# EAGLE design Fuente (EAGLE 6.3)
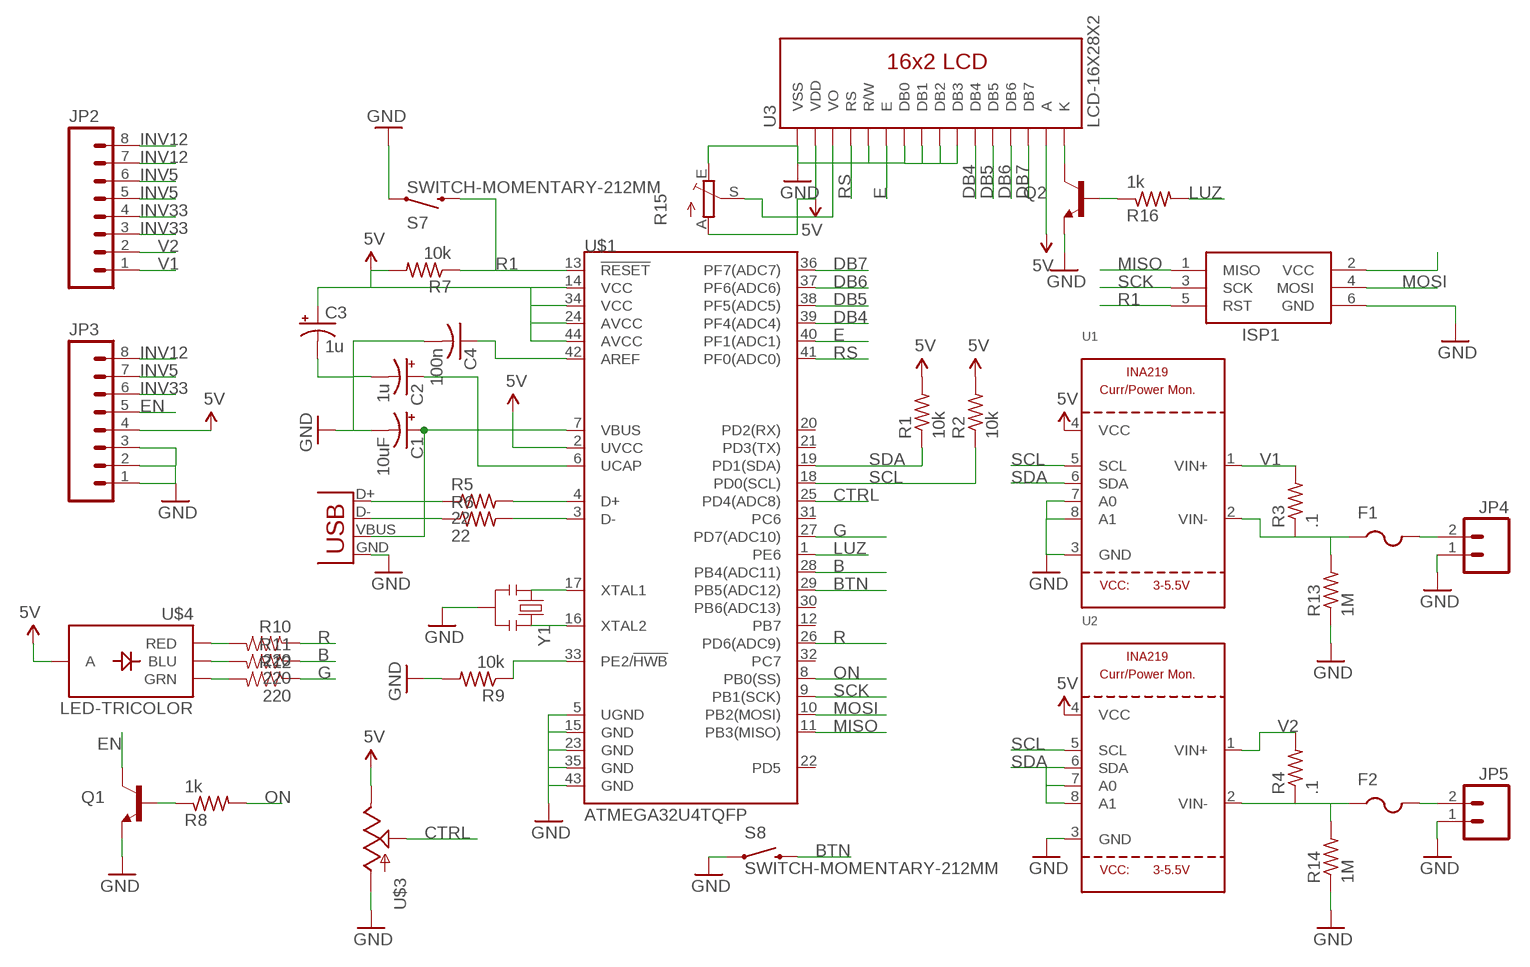
[diagram p0: schematic, sheet 1]

## Parts
C1  10uF  CAP_POLPTH2  [CPOL-RADIAL-10UF-25V]
C2  1u  CPOL-USE2.5-6  [E2,5-6]
C3  1u  CPOL-USE2.5-6  [E2,5-6]
C4  100n  C-USC0805K  [C0805K]
F1  PTCFUSE-1812  [1812]
F2  PTCFUSE-1812  [1812]
ISP1  AVRISP-6  [AVRISP]
JP1  USBSMD  [USB-MINIB]
JP2  M08LONGPADS  [1X08_LONGPADS]
JP3  M08LONGPADS  [1X08_LONGPADS]
JP4  M02LOCK_LONGPADS  [1X02_LOCK_LONGPADS]
JP5  M02LOCK_LONGPADS  [1X02_LOCK_LONGPADS]
Q1  TRANSISTOR_NPNSOT23  [SOT23]
Q2  TRANSISTOR_NPNSOT23  [SOT23]
R1  10k  R-US_M0805  [M0805]
R2  10k  R-US_M0805  [M0805]
R3  .1  R-US_R2512  [R2512]
R4  .1  R-US_R2512  [R2512]
R5  22  R-US_0309/12  [0309/12]
R6  22  R-US_0309/12  [0309/12]
R7  10k  R-US_M0805  [M0805]
R8  1k  R-US_M0805  [M0805]
R9  10k  R-US_M0805  [M0805]
R10  220  RESISTOR0805-RES  [0805]
R11  220  RESISTOR0805-RES  [0805]
R12  220  RESISTOR0805-RES  [0805]
R13  1M  R-US_M0805  [M0805]
R14  1M  R-US_M0805  [M0805]
R15  TRIM_EU-CT6  [CT6]
R16  1k  R-US_M0805  [M0805]
S7  SWITCH-MOMENTARY-212MM  [TACTILE-PTH-12MM]
S8  SWITCH-MOMENTARY-212MM  [TACTILE-PTH-12MM]
U1  INA219  [SOT23-8]
U2  INA219  [SOT23-8]
U3  LCD-16X28X2  [LCD-8X2]
U$1  ATMEGA32U4TQFP  [SPARKFUN-DIGITALIC_TQFP44]
U$3  POT-RV16AF-20  [POT_ALPHA_RV16AF-20]
U$4  LED-TRICOLOR  [LED-TRICOLOR-SMD]
Y1  RESONATORPTH  [RESONATOR-PTH]

## Nets
5V: C3.+ JP3.4 R1.2 R2.2 R7.2 R15.A U1.4(VCC) U2.4(VCC) U3.2(VDD) U3.15(A) U$1.2(UVCC) U$1.14(VCC) U$1.24(AVCC) U$1.34(VCC) U$1.44(AVCC) U$3.3(E) U$4.A
B: R11.1 U$1.28(PB4(ADC11))
BTN: S8.3 U$1.29(PB5(ADC12))
CTRL: U$1.25(PD4(ADC8)) U$3.2(S)
DB4: U3.11(DB4) U$1.39(PF4(ADC4))
DB5: U3.12(DB5) U$1.38(PF5(ADC5))
DB6: U3.13(DB6) U$1.37(PF6(ADC6))
DB7: U3.14(DB7) U$1.36(PF7(ADC7))
E: U3.6(E) U$1.40(PF1(ADC1))
EN: JP3.5 Q1.3(C)
G: R12.1 U$1.27(PD7(ADC10))
GND: C1.2(-) C2.- C3.- C4.2 ISP1.6(GND) JP1.GND JP3.1 JP3.2 JP3.3 JP4.1 JP5.1 Q1.2(E) Q2.2(E) R9.2 R13.1 R14.1 R15.E S7.1 S8.1 U1.3(GND) U1.7(A0) U1.8(A1) U2.3(GND) U3.1(VSS) U3.5(R/W) U3.7(DB0) U3.8(DB1) U3.9(DB2) U3.10(DB3) U$1.5(UGND) U$1.15(GND) U$1.23(GND) U$1.35(GND) U$1.43(GND) U$3.1(A) Y1.2
INV5: JP2.5 JP2.6 JP3.7
INV12: JP2.7 JP2.8 JP3.8
INV33: JP2.3 JP2.4 JP3.6
LUZ: R16.2 U$1.1(PE6)
MISO: ISP1.1(MISO) U$1.11(PB3(MISO))
MOSI: ISP1.4(MOSI) U$1.10(PB2(MOSI))
N$1: Q1.1(B) R8.1
N$2: F2.1 R4.1 R14.2 U2.2(VIN-)
N$3: C1.1(+) JP1.VBUS U$1.7(VBUS)
N$4: R9.1 U$1.33(PE2/!HWB)
N$5: ISP1.2(VCC)
N$6: R10.2 U$4.R(RED)
N$7: F1.1 R3.1 R13.2 U1.2(VIN-)
N$8: JP1.D+ R5.1
N$9: R5.2 U$1.4(D+)
N$10: R6.2 U$1.3(D-)
N$11: JP1.D- R6.1
N$12: U$1.17(XTAL1) Y1.1
N$13: U$1.16(XTAL2) Y1.3
N$14: R11.2 U$4.B(BLU)
N$15: R12.2 U$4.G(GRN)
N$16: F1.2 JP4.2
N$17: F2.2 JP5.2
N$18: C4.1 U$1.42(AREF)
N$19: Q2.1(B) R16.1
N$21: R15.S U3.3(VO)
N$22: C2.+ U$1.6(UCAP)
N$29: Q2.3(C) U3.16(K)
ON: R8.2 U$1.8(PB0(SS))
R: R10.1 U$1.26(PD6(ADC9))
R1: ISP1.5(RST) R7.1 S7.3 U$1.13(!RESET)
RS: U3.4(RS) U$1.41(PF0(ADC0))
SCK: ISP1.3(SCK) U$1.9(PB1(SCK))
SCL: R2.1 U1.5(SCL) U2.5(SCL) U$1.18(PD0(SCL))
SDA: R1.1 U1.6(SDA) U2.6(SDA) U2.7(A0) U2.8(A1) U$1.19(PD1(SDA))
V1: JP2.1 R3.2 U1.1(VIN+)
V2: JP2.2 R4.2 U2.1(VIN+)
Unconnected: U$1.12(PB7) U$1.20(PD2(RX)) U$1.21(PD3(TX)) U$1.22(PD5) U$1.30(PB6(ADC13)) U$1.31(PC6) U$1.32(PC7)

## Library data of the parts
C1 = SparkFun-Capacitors:CAP_POL: Capacitor Polarized These are standard SMD and PTH capacitors. Normally 10uF, 47uF, and 100uF in electrolytic and tantalum varieties. Always verify the external diameter of the through hole cap, it varies with capacity, voltage, and manufacturer. The EIA devices should be standard.
C2 C3 = adafruit:CPOL-US: POLARIZED CAPACITOR, American symbol
C4 = adafruit:C-US: CAPACITOR, American symbol
F1 F2 = adafruit:PTCFUSE: PTC fuses, resettable thermistors
ISP1 = adafruit:AVRISP: AVR ISP HEADER Standard 6 pin header for AVR programming
JP1 = SparkFun-Connectors:USB: USB Connectors USB-B-PTH is fully proven SKU : PRT-00139/CONN-08278 USB-miniB is fully proven SKU : PRT-00587 USB-A-PCB is untested. USB-A-H is throughly reviewed, but untested. Spark Fun Electronics SKU : PRT-00437 USB-B-SMT is throughly reviewed, but untested. Needs silkscreen touching up. USB-A-S has not been used/tested USB-MB-H has not been used/tested USB-MICROB has been used. CONN-09505
JP2 JP3 = SparkFun-Connectors:M08: Header 8 Standard 8-pin 0.1" header. Use with straight break away headers (SKU : PRT-00116), right angle break away headers (PRT-00553), swiss pins (PRT-00743), machine pins (PRT-00117), and female headers (PRT-00115).
JP4 JP5 = SparkFun-Connectors:M02: Header 2 Standard 2-pin 0.1" header. Use with straight break away headers (SKU : PRT-00116), right angle break away headers (PRT-00553), swiss pins (PRT-00743), machine pins (PRT-00117), and female headers (PRT-00115). Molex polarized connector foot print use with SKU : PRT-08233 with associated crimp pins and housings.
Q1 Q2 = SparkFun-DiscreteSemi:TRANSISTOR_NPN: Generic NPN BJT. MMBT2222 is the common NPN we use. Double check against datasheet- not all devices are the same!
R1-R9 R13 R14 R16 = adafruit:R-US_: RESISTOR, American symbol
R10-R12 = SparkFun-Resistors:RESISTOR: Resistor Basic schematic elements and footprints for 0603, 1206, and PTH resistors.
R15 = pot:TRIM_EU-: POTENTIOMETER
S7 S8 = SparkFun-Electromechanical:SWITCH-MOMENTARY-2: Various NO switches- pushbuttons, reed, etc
U1 U2 = microbuilder:INA219: INA219 - I2C Current/Power Monitor Voltage Range: 0-26V Accuracy: 0.5% Temperature: -40°C - 125°C
U3 = SparkFun-Displays:LCD-16X2: Standard text-only 16x2 parallel input LCD
U$1 = SparkFun-DigitalIC:ATMEGA32U4: Atmel 44-pin 8-bit Microcontroller with 32KBytes of ISP Flash and USB Controller
U$3 = SparkFun-Electromechanical:POT
U$4 = SparkFun-LED:LED-TRICOLOR: Tri-Color LED SMD Proven layout and schematic for triple color LED in SMD package - common anode. Spark Fun Electronics SKU : COM-07844
Y1 = SparkFun-FreqCtrl:RESONATOR: Resonator Small SMD resonator. Used, eg, on the Arduino Pro/ Pro Mini boards. 8MHz- XTAL-08895 16MHz- XTAL-08900

## Board
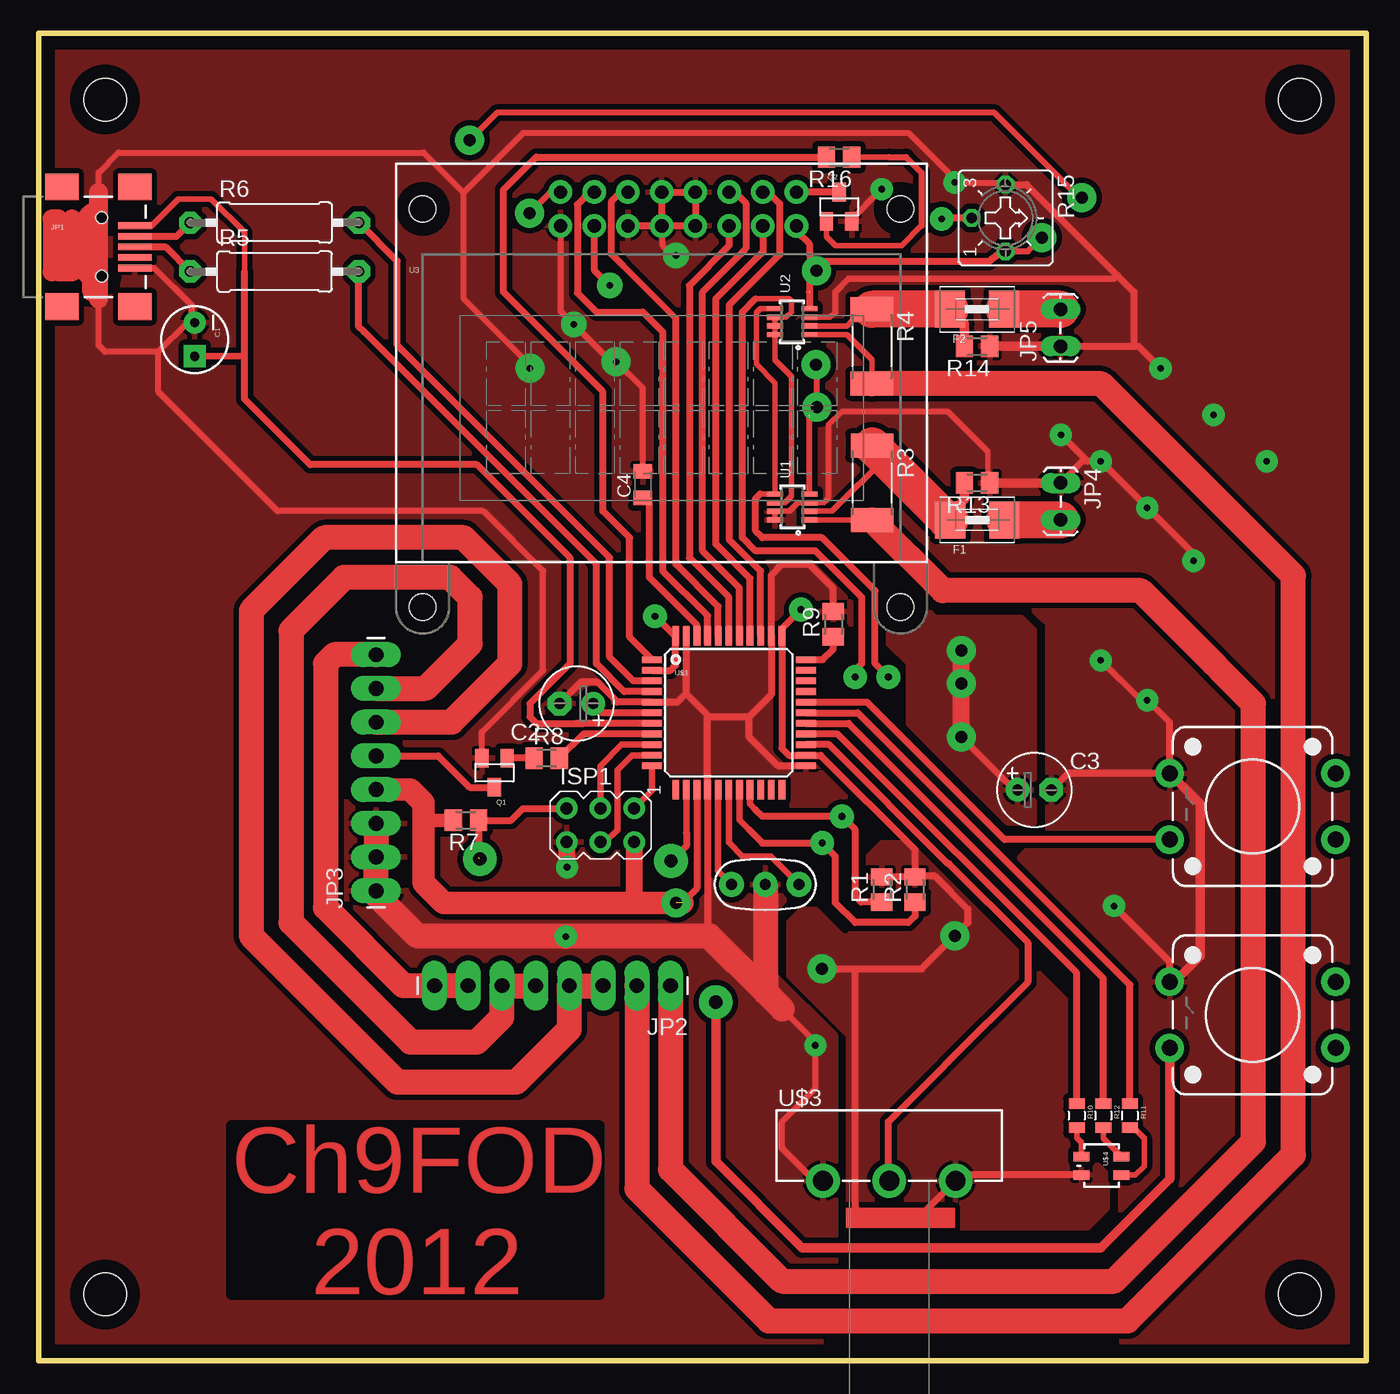
[diagram p1: board, top side]
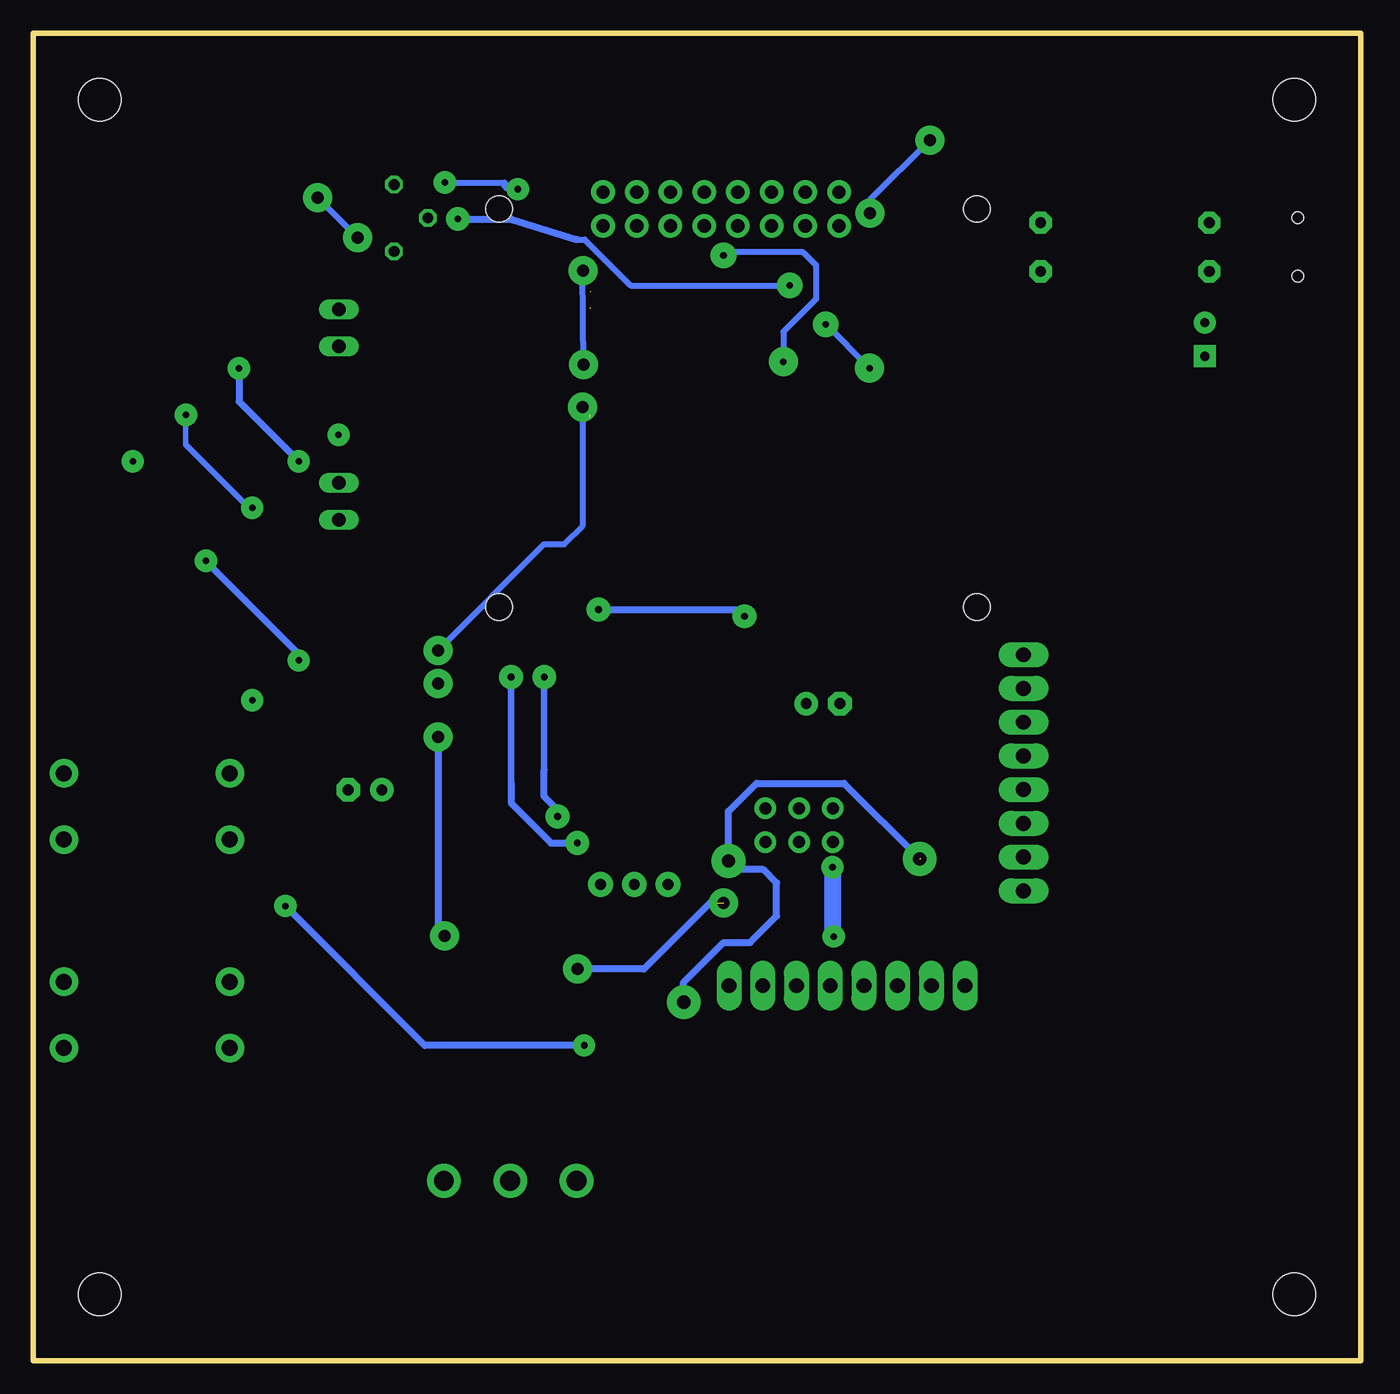
[diagram p2: board, bottom side, seen from below]

Size 100 x 100 mm. Coordinates in mm from the lower left corner, seen from the top.
Outline: 0,10 0,90 0,100 100,100 100,90 100,10 100,0 0,0 0,10
Copper layers (1*16): Top 0.035mm / dielectric 1.5mm / Bottom 0.035mm
Design rules "default": minimum track width 10mil, minimum drill 24mil, track to track 8mil, track to pad 8mil, pad to pad 8mil, via to via 8mil, smd to smd 8mil, copper to edge 40mil, drill to drill 8mil, minimum pad ring 10mil, minimum via ring 8mil, stop-mask expansion 4mil, vias tented up to drill 0mil, thermal gap 10mil
Holes 3.2 mm at 5,95 95,95 5,5 95,5

### Footprints (pad centres in the part's own frame; a part is rotated, then mirrored left to right if it is on the bottom)
CPOL-RADIAL-10UF-25V = drill 0.7 pad 1.651 square: 1 1.27,0 | drill 0.7 pad 1.651: 2 -1.27,0
E2,5-6 = drill 0.813 pad 1.778: + -1.27,0 | drill 0.813 pad 1.778 octagon: - 1.27,0
C0805K = smd 1.1 x 1.4: 1 -1,0; 2 1,0
1812 = smd 2.286 x 2.794: 1 -2.046,0; 2 2.046,0
AVRISP = drill 0.9 pad 1.626: 1 -1.27,2.54; 2 1.27,2.54; 3 -1.27,0; 4 1.27,0; 5 -1.27,-2.54; 6 1.27,-2.54
USB-MINIB = smd 2.5 x 0.5: D+ 2.5,0; D- 2.5,0.8; GND 2.5,-1.6; ID 2.5,-0.8; VBUS 2.5,1.6 | smd 2.5 x 2: MTN1 -3,4.5; MTN2 2.5,4.5; MTN3 -3,-4.5; MTN4 2.5,-4.5 | hole 0.9: 0,2.2; 0,-2.2
1X08_LONGPADS = drill 1.118 pad 1.88 long: 1 0,0; 2 2.54,0; 3 5.08,0; 4 7.62,0; 5 10.16,0; 6 12.7,0; 7 15.24,0; 8 17.78,0
1X02_LOCK_LONGPADS = drill 1.016 long: 1 -0.127,0; 2 2.667,0
SOT23 = smd 1 x 1.4: 1 -0.95,-1.1; 2 0.95,-1.1; 3 0,1.1
M0805 = smd 1.3 x 1.6: 1 -0.95,0; 2 0.95,0
R2512 = smd 1.8 x 3.2: 1 -2.8,0; 2 2.8,0
0309/12 = drill 0.813 pad 1.676 octagon: 1 -6.35,0; 2 6.35,0
0805 = smd 0.8 x 1.2: 1 -0.9,0; 2 0.9,0
CT6 = drill 0.813 octagon: A 2.515,0; E -2.515,0; S 0,-2.54
TACTILE-PTH-12MM = drill 1.2 pad 2.159: 1 6.25,-2.5; 2 -6.25,-2.5; 3 6.25,2.5; 4 -6.25,2.5
SOT23-8 = smd 0.4 x 1.2: 1 -0.975,-1.3; 2 -0.325,-1.3; 3 0.325,-1.3; 4 0.975,-1.3; 5 0.975,1.3; 6 0.325,1.3; 7 -0.325,1.3; 8 -0.975,1.3
LCD-8X2 = drill 1 pad 1.778: 1 -7.62,13.73; 2 -7.62,16.27; 3 -5.08,13.73; 4 -5.08,16.27; 5 -2.54,13.73; 6 -2.54,16.27; 7 0,13.73; 8 0,16.27; 9 2.54,13.73; 10 2.54,16.27; 11 5.08,13.73; 12 5.08,16.27; 13 7.62,13.73; 14 7.62,16.27; 15 10.16,13.73; 16 10.16,16.27 | hole 2: 18,15; -18,15; -18,-15; 18,-15
SPARKFUN-DIGITALIC_TQFP44 = smd 1.5 x 0.5: 1 -5.8,4; 2 -5.8,3.2; 3 -5.8,2.4; 4 -5.8,1.6; 5 -5.8,0.8; 6 -5.8,0; 7 -5.8,-0.8; 8 -5.8,-1.6; 9 -5.8,-2.4; 10 -5.8,-3.2; 11 -5.8,-4; 23 5.8,-4; 24 5.8,-3.2; 25 5.8,-2.4; 26 5.8,-1.6; 27 5.8,-0.8; 28 5.8,0; 29 5.8,0.8; 30 5.8,1.6; 31 5.8,2.4; 32 5.8,3.2; 33 5.8,4 | smd 0.5 x 1.5: 12 -4,-5.8; 13 -3.2,-5.8; 14 -2.4,-5.8; 15 -1.6,-5.8; 16 -0.8,-5.8; 17 0,-5.8; 18 0.8,-5.8; 19 1.6,-5.8; 20 2.4,-5.8; 21 3.2,-5.8; 22 4,-5.8; 34 4,5.8; 35 3.2,5.8; 36 2.4,5.8; 37 1.6,5.8; 38 0.8,5.8; 39 0,5.8; 40 -0.8,5.8; 41 -1.6,5.8; 42 -2.4,5.8; 43 -3.2,5.8; 44 -4,5.8
POT_ALPHA_RV16AF-20 = drill 1.5 pad 2.54: 1 -5,0; 2 0,0; 3 5,0
LED-TRICOLOR-SMD = smd 0.7 x 1.2: A 0.7,-1.5; B 0.7,1.5; G -0.7,1.5; R -0.7,-1.5
RESONATOR-PTH = drill 0.8 pad 1.88: 1 -2.54,0; 2 0,0; 3 2.54,0

### Placement (x,y rotation side)
C1  11.74,76.93 270 top
C2  40.5,49.5 180 top
C3  75,43 0 top
C4  45.5,66 90 top
F1  70.69,63.33 0 top
F2  70.68,79.2 0 top
ISP1  42.31,40.34 270 top
JP1  4.74,83.9 0 top
JP2  47.59,28.25 180 top
JP3  25.4,35.4 90 top
JP4  76.98,66 270 top
JP5  76.96,76.54 90 top
Q1  34.32,44.29 180 top
Q2  60.29,86.92 0 top
R1  63.5,35.5 90 top
R2  66,35.5 90 top
R3  62.77,66.13 270 top
R4  62.75,76.4 270 top
R5  17.76,82.05 0 top
R6  17.76,85.73 0 top
R7  32.18,40.71 180 top
R8  38.25,45.39 0 top
R9  59.85,55.48 90 top
R10  78.19,18.46 270 top
R11  82.19,18.46 270 top
R12  80.19,18.46 270 top
R13  70.68,66.12 180 top
R14  70.68,76.41 180 top
R15  72.82,86.08 270 top
R16  60.29,90.67 180 top
S7  91.44,26.05 180 top
S8  91.44,41.75 180 top
U1  56.77,64.31 90 top
U2  56.75,78.27 90 top
U3  46.92,71.76 0 top
U$1  51.98,48.81 0 top
U$3  64.06,13.55 0 top
U$4  80.05,14.69 270 top
Y1  54.72,35.88 180 top

### Tracks (layer width: path | path; a pad name or v marks a point on that pad's centre or on a via)
5V  (via drill 0.5 pad 1.78, 0.9 pad 2.18)  (4 unrouted)
  Top 0.4: 58.07,71.03
  Top 0.45: 58.1,82.79 58.1,82.58 v58.57,82.11 | U1.4 58.07,71.25 v58.63,71.82 58.63,74.95 v58.54,75.04 | U3.2 38.54,88.03 v36.96,86.45 | v78.57,87.61 78.39,87.61 72,94 34.51,94 v32.46,91.95 | R15.A 74.52,83.57 v75.57,84.61
  Top 0.51: U$1.24 56.5,45.61 55.98,46.13 U$1.34 55.98,55.14 v57.42,56.58 | U$1.24 | U$1.2 47.59,52.01 47.98,52.4 U$1.44 47.89,54.61 v46.42,56.08 | U3.15 57.08,85.1 58.05,84.13 58.1,82.79 | 58.1,82.79 58.05,80.53 58.03,80.52 | 58.04,80.5 58.04,79.32 58.01,79.31 | R15.A 72.57,83.57 71.56,82.79 58.1,82.79 | U$1.24 58.89,45.61 66,38.5 R2.2 | R2.2 R1.2 | 29.29,40.71 29,41 | U$1.14 49.58,35.58 48.5,34.5 | U$4.A 69.5,13.99 | 69.5,13.99 U$3.3 | 69.5,13.99 69.49,13.99 66,10.5 62.5,10.5 61.5,11.5 61.5,29.5 | 61.5,29.5 66.5,29.5 70,33 70,34 67.5,36.5 66.05,36.5 R2.2 | v59,29.5 61.5,29.5 | C3.+ 73.5,43 v69.5,47
  Top 1: R7.2 29.29,40.71
  Top 1.27: v69.5,47 v69.5,51 v69.5,53.5
  Top 1.676: JP3.4 27.98,43.02 29,42 29,41 29,36 30.5,34.5 48.5,34.5
  Bottom 0.45: v58.54,75.04 58.63,82.05 v58.57,82.11 | v69.5,53.5 61.5,61.5 60,61.5 58.63,62.87 v58.63,71.82 | v36.96,86.45 36.96,87.45 v32.46,91.95 | v75.57,84.61 v78.57,87.61
  Bottom 0.51: v48,34.5 49,34.5 54,29.5 v59,29.5 | v69.5,47 69.5,32.5 v69,32 | v57.42,56.58 46.92,56.58 v46.42,56.08
  pour Top (isolate 0.406): 61,32 60.5,32 58.5,34 57.5,34 56.5,33 56.5,29 61,24.5 61,11.5 62.5,10 79,10 80.5,11.5 80.5,14 77.5,17 77.5,27 65.5,39 63.5,39 62.5,38 62.5,33.5
  pour Top (isolate 0.406): 75,40.5 75,55 74,56 67.5,56 65.5,58 64.5,58 64,57.5 64,54 65.5,52.5 65.5,48 68.5,45 73,40.5
B
  Top 0.51: U$1.28 61.69,48.81 82.19,28.31 R11.1
BTN
  Top 0.51: U$1.29 62.39,49.61 72.75,39.25 S8.3
CTRL
  Top 0.51: U$1.25 59.53,46.41 68.5,37.44 68.56,37.44 74.5,31.5 74.5,28.5 68.5,22.5 68,22 64,18 64,13.5 U$3.2
DB4
  Top 0.51: U3.11 52,84 49,81 49,60.5 51.98,57.52 U$1.39
DB5
  Top 0.51: U$1.38 52.78,58.22 50,61 50,80.5 53.27,83.77 53.27,87.19 52.44,88.03 U3.12
DB6
  Top 0.51: U$1.37 53.58,58.92 51,61.5 51,80 54.54,83.54 U3.13
DB7
  Top 0.51: U$1.36 54.38,59.5 52,61.87 52,79.5 55.81,83.31 55.81,87.16 54.94,88.03 U3.14
E
  Top 0.45: 44,82.5 48,78.5
  Top 0.51: U$1.40 51.18,56.82 48,60 48,78.5 | U3.6 43.84,88.03 43.11,87.3 43.11,83.39 44,82.5
EN
  Top 0.51: JP3.5 30.1,45.56 32.47,43.19 Q1.3
G
  Top 0.51: U$1.27 60.99,48.01 80.18,28.82 R12.1
GND  (via drill 0.5 pad 1.68, 0.5 pad 1.93, 0.5 pad 2.18)
  Top 0.4: U1.8 U1.7 | U1.7 56.55,63.98 57.2,64.63 U1.3 59.13,64.63 59.5,65 59.5,70.5 60.5,71.5 68.5,71.5 71.5,68.5 71.5,66.25 R13.1 | U1.7
  Top 0.41: U2.3 59.59,78.59 60,79 | Q2.2 61.24,86.01 63.22,87.98
  Top 0.45: 63.22,87.98 63.23,87.98 v63.5,88.25 | R15.E 72.66,88.75 v69,88.75 69,89 65.5,92.5 36.5,92.5 32,88 | C4.2 45.5,73.25 v43.5,75.25 43.12,75.25 v40.3,78.08 39.3,79.07 U3.1 | v37,74.75 37,75 32,80 32,88 | C1.2 11.2,78.2 9,76 | 9,76 5,76 4.5,76.5 4.5,80 | 4.5,88 4.5,89.5 6,91 29,91 32,88 | v48,83.25 47.75,83.25 47,84 47,85.41 U3.7 | 83,49.75 v80,52.75 | v83.5,49.75 85.19,48.06 | 56,16 56,18 58.5,20.5 58.5,23.25 59,23.75 58.75,23.75 56,26.5 | Q1.2 33.37,47.37 38,52 38,59.5 33.5,64 18,64 9,73 9,76
  Top 0.5: JP1.GND 8.7,82.3 11.5,79.5 11.5,78.44 C1.2 | 60,79 60,80.5 61,81.5 81,81.5 81.25,81.75
  Top 0.51: 48.75,50.25 48.1,49.61 U$1.5 43.59,49.61 42.08,51.12 40.85,51.12 C2.- | 48.75,50.25 48.78,50.29 U$1.43 | 50.38,48.62 U$1.15 50.38,32.12 50.5,32 | 50.38,48.62 48.75,50.25 | 53.5,48.5 55.18,50.18 U$1.35 55.18,59.18 56,60 58,60 59.85,58.15 R9.2 | 53.5,48.5 50.5,48.5 50.38,48.62 | U$1.23 55.69,44.81 53.5,47 53.5,48.5 | U3.5 U3.7 | U3.7 U3.9 U3.10 U3.8 U3.7 | ISP1.6 | U$3.1 58.45,13.55 56,16 | C3.- 77.52,44.25 S8.1 85.19,48.06 | S7.1 85.19,30.06 v81,34.25 | v83.5,49.75 83,49.75 | v87,60.25 87,60.75 v83.5,64.25 v80,67.75 | v80,67.75 79,67.75 v77,69.75 | v80,67.75 78.61,67.75 JP4.1 | R14.1 82.5,76.41 | 82.5,76.41 82.84,76.41 v84.5,74.75 | R15.E 74.4,88.6 81.25,81.75 82.5,80.5 82.5,76.41
  Top 0.7: JP4.1 R13.1 | JP5.1 R14.1 | S7.1 85.55,28.55 87.5,30.5 87.5,41.94 S8.1
  Top 1.27: ISP1.6 39.77,37.21 v39.79,37.18
  Top 1.422: 4.5,80 4.5,88
  Top 1.9: JP3.3 JP3.2 JP3.1 25.4,35.1 28.5,32 50.5,32 54.72,27.78 | 54.72,27.78 56,26.5 | Y1.2 54.72,27.78
  Bottom 0.45: v63.5,88.25 64,88.25 | 64,88.25 64.25,88.25 64.5,88.5 | v69,88.75 64.5,88.75 64,88.25 | v37,74.75 v40.3,78.08 40.31,78.25 | v48,83.25 47.75,83.5 42,83.5 41,82.5 41,80 43.5,77.5 v43.5,75.25 | 40.31,78.25 40.03,78.53 | 40.31,78.25 40.53,78.03
  Bottom 0.51: 39.77,32.03 v39.69,31.95 | v58.5,23.75 70.5,23.75 v81,34.25 | v80,52.75 80,53.25 v87,60.25 | v84.5,74.75 84.5,72.25 v80,67.75
  Bottom 1.27: 39.76,32.02 v39.69,31.95 | 39.77,32.03 39.77,37.16 v39.79,37.18
  other vias: 88.5,71.25 92.5,67.75
  pour Top (isolate 0.406): 0,0 57.5,0 60,2.5 60,24.5 55.5,29 55.5,34 62,40.5 62,54 66.5,58.5 73,58.5 75.5,56 76,55.5 76,40 75.5,39.5 71.5,35.5 71.5,34.5 73,33 81,25 81.5,24.5 81.5,1.5 83,0 100,0 100,100 0,100
INV5
  Top 1.9: JP2.5 JP2.6 34.9,25.88 33.01,24 28,24 19,33 19,55 23,59 31,59 32.5,57.5 32.5,54 29.14,50.64 JP3.7
INV12
  Top 1.9: JP2.7 JP2.8 27.47,28.25 21.59,34.13 21.59,52.5 22.27,53.18 JP3.8
INV33
  Top 1.9: JP2.3 JP2.4 39.97,24.99 35.97,21 27,21 16,32 16,56.5 21.5,62 32,62 35.5,58.5 35.5,52.5 31.1,48.1 JP3.6
LUZ
  Top 0.51: U$1.1 46.18,52.82 44.5,54.5 44.5,62 42.5,64 42.5,73 35,80.5 35,88.19 37.47,90.67 R16.2
MISO
  Top 0.5: U$1.11 46.18,42.94 ISP1.1
MOSI
  Top 0.5: ISP1.4 42.66,39.07 43.59,39.99 43.59,44.49 44.7,45.61 U$1.10
N$1
  Top 0.51: R8.1 Q1.1
N$2
  Top 0.4: U2.2 60.87,77.94 61.34,78.42 61.97,78.42 R4.1
  Top 0.7: R14.2 69.73,78.1 F2.1
  Top 2.8: F2.1 R4.1
N$3
  Top 0.41: 15.5,82 15.5,85 13,87.5 10.5,87.5 8.5,85.5
  Top 0.5: JP1.VBUS 8.5,85.5 | C1.1 15.34,75.66 15.5,75.5
  Top 0.51: 15.5,82 15.5,75.5 15.5,72.45 20.45,67.5 33,67.5 40,60.5 40,52.5 37,49.5 37,48.5 37.5,48 40.99,48 41,48.01 | U$1.7 41,48.01 | 41,48.01 40.49,48.01
N$4
  Top 0.51: U$1.33 59.03,52.81 59.85,53.63 R9.1
N$5
  Top 1.27: ISP1.2 44.85,34.65 45,34.5
N$6
  Top 0.406: R10.2 78.19,16.79 78.54,16.44 U$4.R
N$7
  Top 0.4: U1.2 59.75,63.98 60.54,64.78 | 60.54,64.78 | 60.54,64.78 63.06,67.29 63.21,67.29 63.81,67.89
  Top 0.7: R13.2 69.73,64.87 68.27,63.41 68.57,63.41 F1.1
  Top 2.8: F1.1 68.37,63.33 63.81,67.89 R3.1
N$8
  Top 0.51: JP1.D+ 9.55,83.9 R5.1
N$9
  Top 0.51: U$1.4 44.09,50.41 42,52.5 42,60 24.5,77.5 24.1,77.89 R5.2
N$10
  Top 0.51: U$1.3 44.79,51.21 43,53 43,60.5 27,76.5 27,82.84 R6.2
N$11
  Top 0.51: JP1.D- 10.39,84.7 R6.1
N$12
  Top 0.5: U$1.17 51.98,39.02 53,38 55.14,38 Y1.1
N$13
  Top 0.5: U$1.16 51.18,36.88 Y1.3
N$14
  Top 0.406: R11.2 82.49,17.56 83.28,16.77 83.28,14.64 82.62,13.99 U$4.B
N$15
  Top 0.406: R12.2 80.19,16.75 U$4.G
N$16
  Top 2.8: JP4.2 F1.2
N$17
  Top 2.8: JP5.2 F2.2
N$18
  Top 0.51: U$1.42 49.58,55.42 46,59 46,64.5 C4.1
N$19
  Top 0.41: Q2.1 59.34,84.66 60,84 65,84 | 64.05,90.66 R16.1
  Top 0.45: 64.05,90.66 65.34,90.66 66.5,89.5 66.5,85.5 65,84
N$20
  Bottom 0.4: 88.5,71.5 88.5,69 83.5,64
N$21  (via drill 0.5 pad 1.78, 0.5 pad 1.93)
  Top 0.51: U3.3 41.84,82.16 v43,81 | R15.S 67.61,86.08 v68,86
  Bottom 0.45: 59.02,84.46 58.46,84.46 55,81 v43,81
  Bottom 0.51: v68,86 64,86 59.02,84.46
N$22
  Top 0.51: U$1.6 42.46,48.81 C2.+
N$23
  Top 1.422: 4,80.5 4,81.5 3.5,82 3.5,86 4,86.5
N$24
  Top 1.422: 2.5,86 2.5,82 1.5,82 1.5,86 1,86 1,82
N$29
  Top 0.51: Q2.3 U3.16
ON
  Top 0.51: U$1.8 41.02,47.21 R8.2
R
  Top 0.51: U$1.26 60.18,47.21 78.19,29.2 R10.1
R1  (via drill 1 pad 2.54)  (1 unrouted)
  Top 0.5: ISP1.5 39.89,41.61 | U$1.13 48.78,39.78
  Top 0.51: 33.13,37.87 R7.1 35.58,40.71 36.46,41.6 ISP1.5 | 48.78,39.78 48.78,38.79 v47.62,37.64
  Top 0.7: S7.3 85.19,13.69 80,8.5 57.5,8.5 51,15 v51,27
  Bottom 0.51: v33.22,37.79 38.92,43.5 45.5,43.5 47.62,41.38 v47.62,37.64 46.99,37 45,37 44,36 44,33.5 46,31.5 48,31.5 51,28.5 v51,27
RS
  Top 0.51: U$1.41 50.38,56.12 47,59.5 47,77.5 45.5,79 42,79 40.56,80.44 40.56,87.09 41.5,88.03 U3.4
SCK
  Top 0.5: U$1.9 43.91,46.41 42.31,44.81 ISP1.3
SCL  (via drill 0.5 pad 1.78)
  Top 0.4: U2.5 54.36,79.24 54.05,78.93 54.05,75.05 55.47,73.63 U1.5 54.33,65.28
  Top 0.5: U$1.18 52.78,40.72 53.5,40
  Top 0.51: 54.33,65.28 54,64.95 54,62.5 54.5,62 59,62 63,58 63,52.5 v64,51.5 | 53.5,40 54.5,39 v59,39 | 59.5,39 v59,39 | R2.1 66,33.5 65.5,33 61.5,33 60,34.5 60,38 v59,39
  Bottom 0.5: 64,43.5 v64,51.5
  Bottom 0.51: 64,43.5 64,42 61,39 v59,39
SDA  (via drill 0.5 pad 1.78)
  Top 0.4: U1.6 56.2,64.63 56.69,65.12 56.69,74.12 55.45,75.36 U2.8 | U2.8 | 54,80 56.5,80 56.7,79.8 56.7,79 56.29,78.59 U2.6 U2.7 U2.8
  Top 0.5: U$1.19 53.58,41.92 54,41.5
  Top 0.51: 54,80 53,79 53,62 54,61 58.5,61 62,57.5 62,52.5 61.5,52 v61.5,51.5 | 54,41.5 54.5,41 v60.5,41 61.5,40 61.5,35 61.95,34.55 R1.1
  Bottom 0.5: v61.5,51.5 61.5,44.5
  Bottom 0.51: v60.5,41 60.5,41.5 61.5,42.5 61.5,44.5
V1
  Top 0.4: U1.1 R3.2
  Top 1.9: JP2.1 47.59,14.41 56,6 81,6 91.5,16.5 91.5,49.5 89,52 88.5,52.5 83,58 68.1,58 R3.2
V2
  Top 0.4: U2.1 60.87,77.29 62.75,75.42 R4.2
  Top 1.9: JP2.2 45.05,12.96 55,3 82,3 94.5,15.5 94.5,59.14 92,61.64 91.82,61.82 80.04,73.6 R4.2
(copper drawn outside any net)
  shapes: Top area x1

### Text on the board
Top: Ch9FOD / 2012